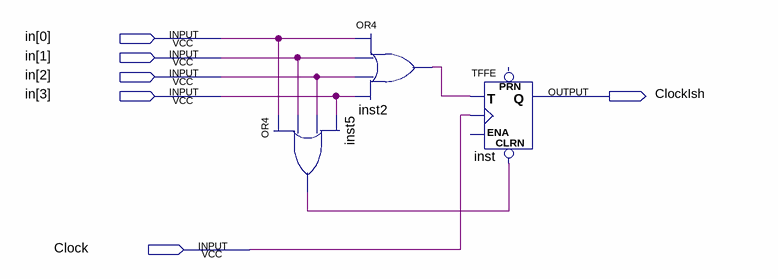
[diagram p0: schematic sheet]
// Quartus schematic clockGate.bdf as structural Verilog: 3 symbols, 6 pins
module clockGate (
  input  [3:0] in,
  input  Clock,
  output ClockIsh
);

  wire inst2_out, inst5_out;

  or inst5 (inst5_out, in[0], in[1], in[2], in[3]);
  or inst2 (inst2_out, in[0], in[1], in[2], in[3]);
  TFFE inst (.CLRN(inst5_out), .T(inst2_out), .CLK(Clock), .Q(ClockIsh));  // open: ENA, PRN
endmodule
